# EAGLE board pork pi (EAGLE 6.5.0)
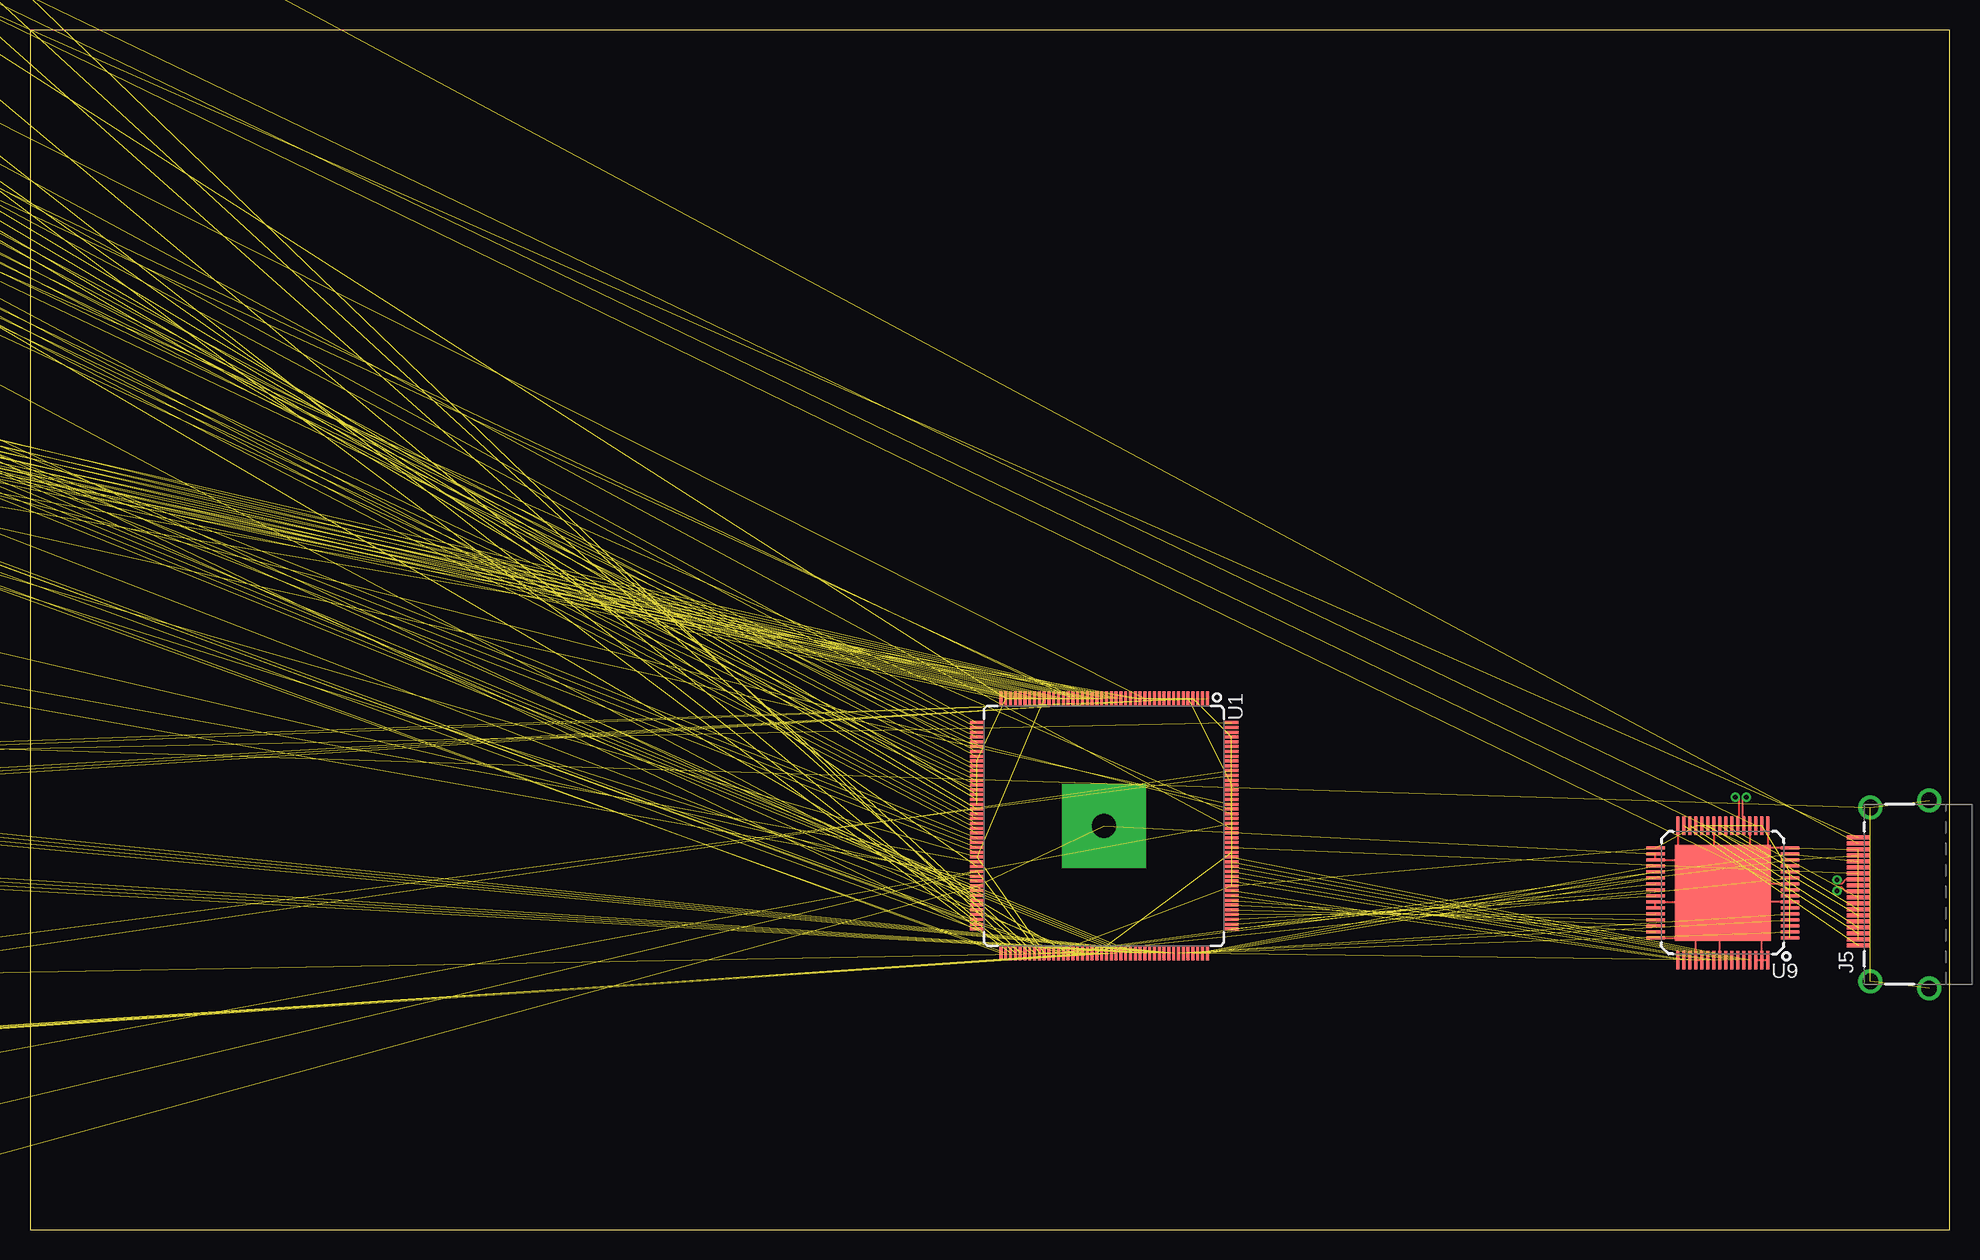
[diagram p3: board, top side]
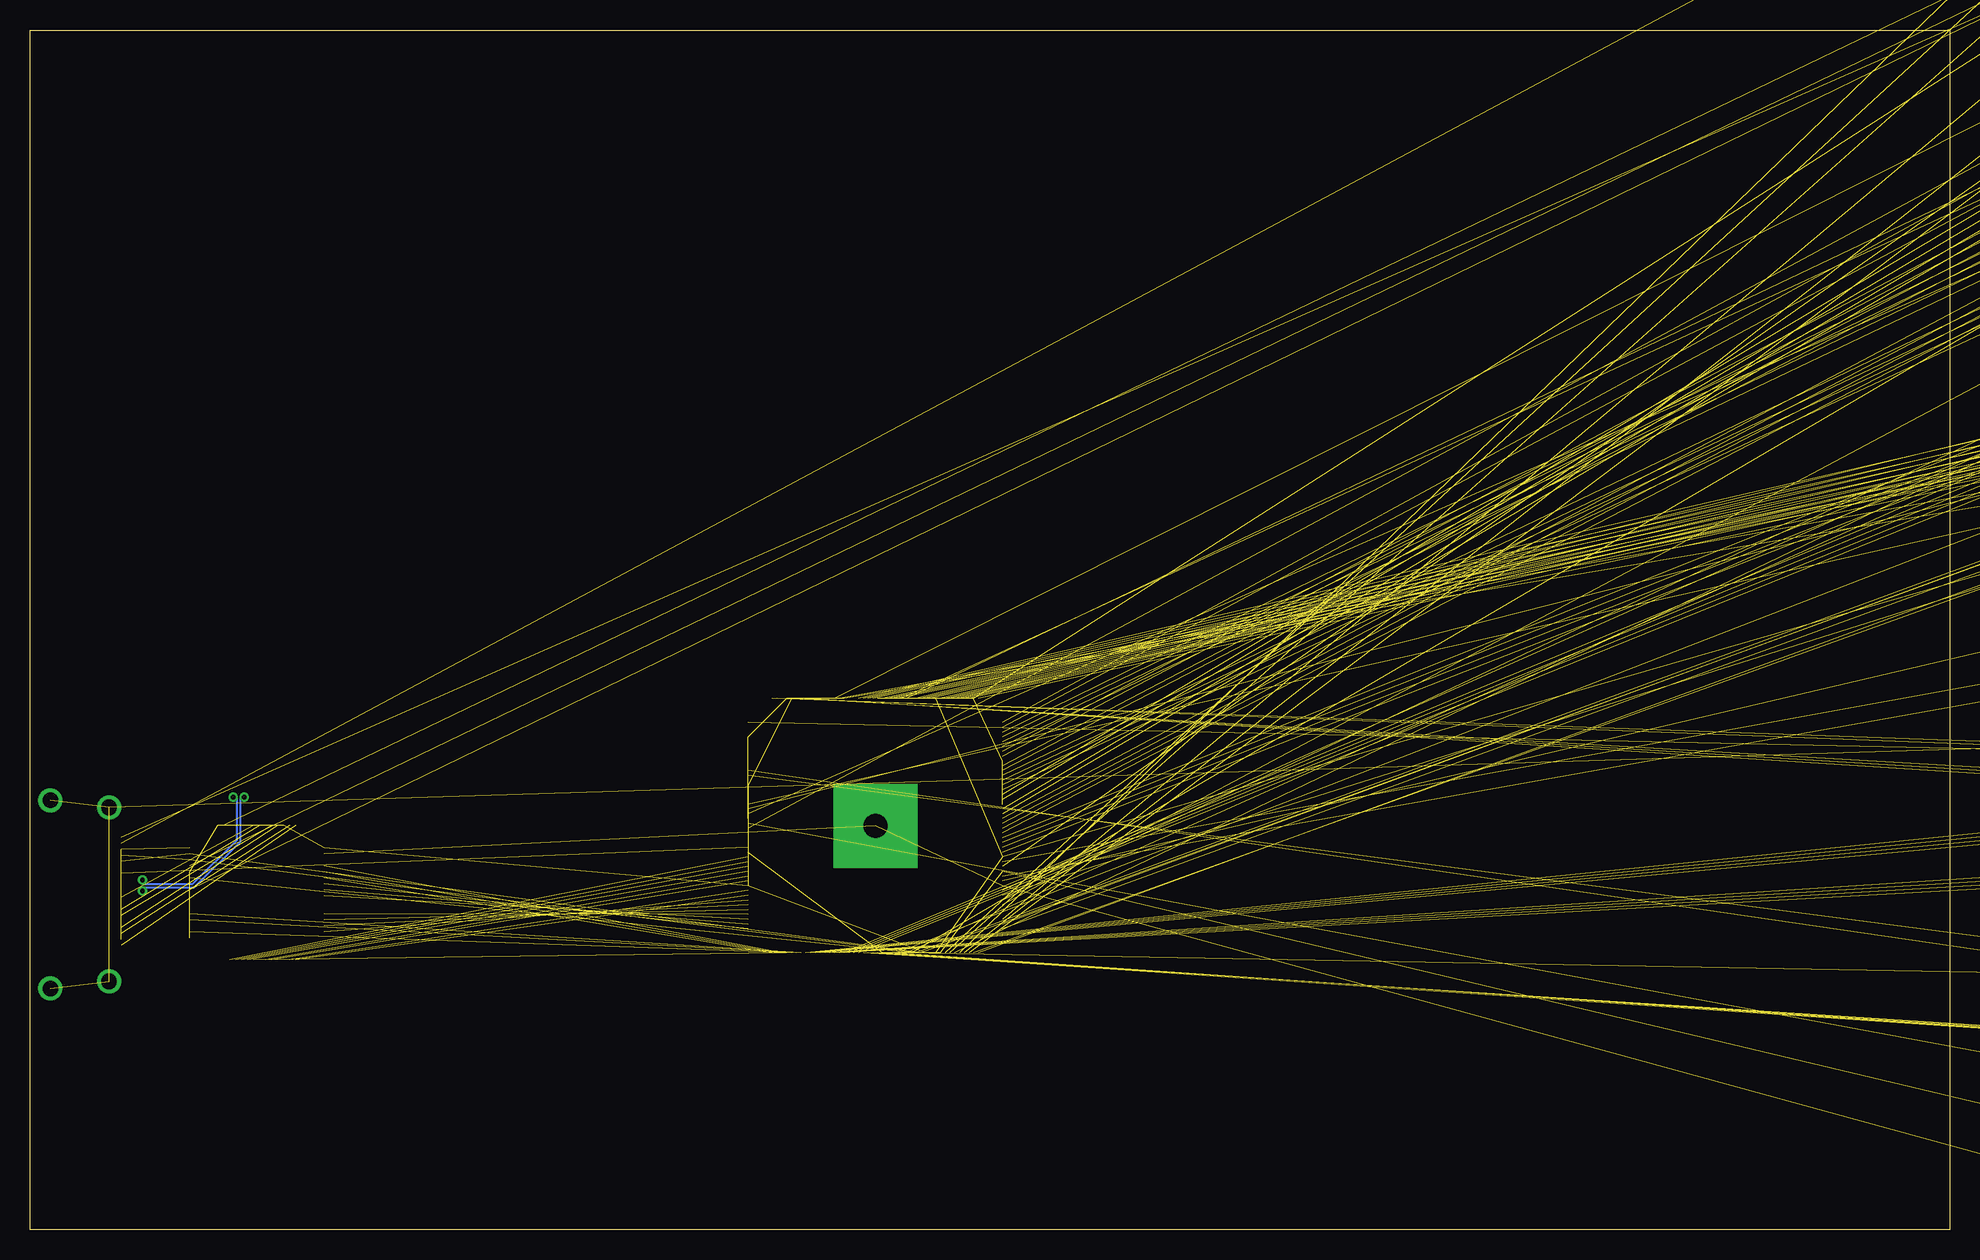
[diagram p4: board, bottom side, seen from below]

Size 160 x 100 mm. Coordinates in mm from the lower left corner, seen from the top.
Outline: 0,0 160,0 160,100 0,100 0,0
Copper layers (1*16): Top 0.0356mm / dielectric 1.5011mm / Bottom 0.0356mm
Design rules "LaenPCBOrder *": minimum track width 6mil, minimum drill 16mil, track to track 6mil, track to pad 6mil, pad to pad 6mil, via to via 6mil, smd to smd 6mil, copper to edge 15mil, drill to drill 6mil, minimum pad ring 7mil, minimum via ring 7mil, stop-mask expansion 3mil, vias tented up to drill 0mil, thermal gap 10mil

## Footprints (pad centres in the part's own frame; a part is rotated, then mirrored left to right if it is on the bottom)
0402-CAP = smd 0.6 x 0.6: 1 -0.55,0; 2 0.55,0
0603-CAP = smd 1.1 x 1: 1 -0.85,0; 2 0.85,0
CAP_POLYMER-6.5X6.5 = smd 1.6 x 3.5: + 0,2.8; - 0,-2.8
SOD123 = smd 1.6 x 0.8: ANODE 1.7,0; CATHODE -1.7,0
SOD-123 = smd 1.6 x 0.8: 1 -1.7,0; 2 1.7,0
SMC = smd 2.5 x 3.3: A 3.45,0; C -3.45,0
SJ-2523-SMT-TR = smd 2.4 x 2.95: 1 1.7,-3.275; 3 4.4,3.275 | smd 2.4 x 2.65: 2 11.4,-3.425; 4 11.4,3.425 | hole 1: 3,0; 9,0
JST-2-SMD = smd 1 x 4.6: 1 -1,-3.7; 2 1,-3.7 | smd 1.6 x 3.4: NC1 -3.4,1.5; NC2 3.4,1.5
MICRO-SD-SOCKET-PP = smd 0.8 x 1.5: 1 -8.94,10.7; 2 -7.84,10.3; 3 -6.74,10.7; 4 -5.64,10.9; 5 -4.54,10.7; 6 -3.44,10.9; 7 -2.34,10.7; 8 -1.24,10.7 | smd 1.8 x 1.4: CD1 -2.05,0.4; CD2 -7.75,0.4 | smd 1.4 x 1.9: GND1 -13.6,14.55; GND3 -0.45,13.55
POWER_JACK_PTH = drill 2.997 pad 4.318: GND 0,7.7; GNDBREAK 4.7,10.7; PWR 0,13.7
HDMI-SMD = smd 0.3 x 1.9: 1 -4.25,0; 2 -3.75,0; 3 -3.25,0; 4 -2.75,0; 5 -2.25,0; 6 -1.75,0; 7 -1.25,0; 8 -0.75,0; 9 -0.25,0; 10 0.25,0; 11 0.75,0; 12 1.25,0; 13 1.75,0; 14 2.25,0; 15 2.75,0; 16 3.25,0; 17 3.75,0; 18 4.25,0; 19 4.75,0 | drill 1.3 pad 2: P$1 7.25,-1; P$2 -7.25,-1; P$3 -7.85,-5.9; P$4 7.85,-5.9
ETHERNET = drill 0.9: 1 -4.445,6.37; 2 -3.175,8.91; 3 -1.905,6.37; 4 -0.635,8.91; 5 0.635,6.37; 6 1.905,8.91; 7 3.175,6.37; 8 4.445,8.91; L1 6.325,-3.35; L2 3.785,-4.87; L3 -3.785,-3.35; L4 -6.325,-4.87 | drill 1.6: P$5 7.775,3.08; P$6 -7.775,3.08 | hole 3.25: 5.715,0.03; -5.715,0.03
USB-MICROB = smd 0.35 x 1.4: D+ 0,2.65; D- -0.65,2.65; GND 1.3,2.65; ID 0.65,2.65; VBUS -1.3,2.65 | smd 1.8 x 1.9: MT1 -4,0; MT2 4,0 | smd 1.9 x 1.9: P$1 -1.27,0; P$2 1.27,0
USB-STACKED = drill 0.92: 1 -3.5,0; 2 -1,0; 3 1,0; 4 3.5,0; 5 -3.5,2.62; 6 -1,2.62; 7 1,2.62; 8 3.5,2.62; 9 -3.5,5.24; 10 -1,5.24; 11 1,5.24; 12 3.5,5.24 | drill 2.3: P$1 -6.57,-2.71; P$2 -6.57,2.97; P$3 6.57,2.97; P$4 6.57,-2.71
1X02 = drill 1.016 pad 1.88: 1 0,0; 2 2.54,0
SJ_3_PASTE1&2 = smd 0.635 x 1.27: 1 -0.813,0; 2 0,0; 3 0.813,0
1X04 = drill 1.016 pad 1.88 square: 1 0,0 | drill 1.016 pad 1.88: 2 2.54,0; 3 5.08,0; 4 7.62,0
NR6028T4R7M = smd 1.6 x 5.7: 1 -2.35,0; 2 2.35,0
0805 = smd 0.8 x 1.2: 1 -0.9,0; 2 0.9,0
LED-1206 = smd 1.2 x 1.4: A -1.5,0; C 1.5,0
2PT_GND_TIE = smd 1.27 x 0.635: P$1 0,0.635; P$2 0,-0.635
SOT23-3 = smd 0.8 x 1: 1 -0.95,-1; 2 0.95,-1; 3 0,1
0402-RES = smd 0.7 x 0.9: 1 -0.65,0; 2 0.65,0
RESISTOR_NETWORK-1206 = smd 0.8 x 0.7: 1 -0.85,-1.3; 4 -0.85,1.3; 5 0.85,-1.3; 8 0.85,1.3 | smd 0.8 x 0.5: 2 -0.85,-0.4; 3 -0.85,0.4; 6 0.85,-0.4; 7 0.85,0.4
FSMSM = smd 2.18 x 1.6: P$1 -4.59,0; P$2 4.59,0
A13 = smd 1.2 x 0.245: 1 -10.6,8.6; 2 -10.6,8.2; 3 -10.6,7.8; 4 -10.6,7.4; 5 -10.6,7; 6 -10.6,6.6; 7 -10.6,6.2; 8 -10.6,5.8; 9 -10.6,5.4; 10 -10.6,5; 11 -10.6,4.6; 12 -10.6,4.2; 13 -10.6,3.8; 14 -10.6,3.4; 15 -10.6,3; 16 -10.6,2.6; 17 -10.6,2.2; 18 -10.6,1.8; 19 -10.6,1.4; 20 -10.6,1; 21 -10.6,0.6; 22 -10.6,0.2; 23 -10.6,-0.2; 24 -10.6,-0.6; 25 -10.6,-1; 26 -10.6,-1.4; 27 -10.6,-1.8; 28 -10.6,-2.2; 29 -10.6,-2.6; 30 -10.6,-3; 31 -10.6,-3.4; 32 -10.6,-3.8; 33 -10.6,-4.2; 34 -10.6,-4.6; 35 -10.6,-5; 36 -10.6,-5.4; 37 -10.6,-5.8; 38 -10.6,-6.2; 39 -10.6,-6.6; 40 -10.6,-7; 41 -10.6,-7.4; 42 -10.6,-7.8; 43 -10.6,-8.2; 44 -10.6,-8.6; 89 10.6,-8.6; 90 10.6,-8.2; 91 10.6,-7.8; 92 10.6,-7.4; 93 10.6,-7; 94 10.6,-6.6; 95 10.6,-6.2; 96 10.6,-5.8; 97 10.6,-5.4; 98 10.6,-5; 99 10.6,-4.6; 100 10.6,-4.2; 101 10.6,-3.8; 102 10.6,-3.4; 103 10.6,-3; 104 10.6,-2.6; 105 10.6,-2.2; 106 10.6,-1.8; 107 10.6,-1.4; 108 10.6,-1; 109 10.6,-0.6; 110 10.6,-0.2; 111 10.6,0.2; 112 10.6,0.6; 113 10.6,1; 114 10.6,1.4; 115 10.6,1.8; 116 10.6,2.2; 117 10.6,2.6; 118 10.6,3; 119 10.6,3.4; 120 10.6,3.8; 121 10.6,4.2; 122 10.6,4.6; 123 10.6,5; 124 10.6,5.4; 125 10.6,5.8; 126 10.6,6.2; 127 10.6,6.6; 128 10.6,7; 129 10.6,7.4; 130 10.6,7.8; 131 10.6,8.2; 132 10.6,8.6 | smd 0.245 x 1.2: 45 -8.6,-10.6; 46 -8.2,-10.6; 47 -7.8,-10.6; 48 -7.4,-10.6; 49 -7,-10.6; 50 -6.6,-10.6; 51 -6.2,-10.6; 52 -5.8,-10.6; 53 -5.4,-10.6; 54 -5,-10.6; 55 -4.6,-10.6; 56 -4.2,-10.6; 57 -3.8,-10.6; 58 -3.4,-10.6; 59 -3,-10.6; 60 -2.6,-10.6; 61 -2.2,-10.6; 62 -1.8,-10.6; 63 -1.4,-10.6; 64 -1,-10.6; 65 -0.6,-10.6; 66 -0.2,-10.6; 67 0.2,-10.6; 68 0.6,-10.6; 69 1,-10.6; 70 1.4,-10.6; 71 1.8,-10.6; 72 2.2,-10.6; 73 2.6,-10.6; 74 3,-10.6; 75 3.4,-10.6; 76 3.8,-10.6; 77 4.2,-10.6; 78 4.6,-10.6; 79 5,-10.6; 80 5.4,-10.6; 81 5.8,-10.6; 82 6.2,-10.6; 83 6.6,-10.6; 84 7,-10.6; 85 7.4,-10.6; 86 7.8,-10.6; 87 8.2,-10.6; 88 8.6,-10.6; 133 8.6,10.6; 134 8.2,10.6; 135 7.8,10.6; 136 7.4,10.6; 137 7,10.6; 138 6.6,10.6; 139 6.2,10.6; 140 5.8,10.6; 141 5.4,10.6; 142 5,10.6; 143 4.6,10.6; 144 4.2,10.6; 145 3.8,10.6; 146 3.4,10.6; 147 3,10.6; 148 2.6,10.6; 149 2.2,10.6; 150 1.8,10.6; 151 1.4,10.6; 152 1,10.6; 153 0.6,10.6; 154 0.2,10.6; 155 -0.2,10.6; 156 -0.6,10.6; 157 -1,10.6; 158 -1.4,10.6; 159 -1.8,10.6; 160 -2.2,10.6; 161 -2.6,10.6; 162 -3,10.6; 163 -3.4,10.6; 164 -3.8,10.6; 165 -4.2,10.6; 166 -4.6,10.6; 167 -5,10.6; 168 -5.4,10.6; 169 -5.8,10.6; 170 -6.2,10.6; 171 -6.6,10.6; 172 -7,10.6; 173 -7.4,10.6; 174 -7.8,10.6; 175 -8.2,10.6; 176 -8.6,10.6 | drill 2 pad 7 square: EP 0,0
QFN-48 = smd 0.6 x 0.248: 1 -2.85,2.2; 2 -2.85,1.8; 3 -2.85,1.4; 4 -2.85,1; 5 -2.85,0.6; 6 -2.85,0.2; 7 -2.85,-0.2; 8 -2.85,-0.6; 9 -2.85,-1; 10 -2.85,-1.4; 11 -2.85,-1.8; 12 -2.85,-2.2; 25 2.85,-2.2; 26 2.85,-1.8; 27 2.85,-1.4; 28 2.85,-1; 29 2.85,-0.6; 30 2.85,-0.2; 31 2.85,0.2; 32 2.85,0.6; 33 2.85,1; 34 2.85,1.4; 35 2.85,1.8; 36 2.85,2.2 | smd 0.248 x 0.6: 13 -2.2,-2.85; 14 -1.8,-2.85; 15 -1.4,-2.85; 16 -1,-2.85; 17 -0.6,-2.85; 18 -0.2,-2.85; 19 0.2,-2.85; 20 0.6,-2.85; 21 1,-2.85; 22 1.4,-2.85; 23 1.8,-2.85; 24 2.2,-2.85; 37 2.2,2.85; 38 1.8,2.85; 39 1.4,2.85; 40 1,2.85; 41 0.6,2.85; 42 0.2,2.85; 43 -0.2,2.85; 44 -0.6,2.85; 45 -1,2.85; 46 -1.4,2.85; 47 -1.8,2.85; 48 -2.2,2.85 | drill 1.5 pad 4.05 square: EP 0,0
MSOP-8 = smd 1.35 x 0.45: 1 -1.975,0.975; 2 -1.975,0.325; 3 -1.975,-0.325; 4 -1.975,-0.975; 5 1.975,-0.975; 6 1.975,-0.318; 7 1.975,0.325; 8 1.975,0.975
HC-05 = smd 1.2 x 1: 1 -6.55,6; 2 -6.55,4.5; 3 -6.55,3; 4 -6.55,1.5; 5 -6.55,0; 6 -6.55,-1.5; 7 -6.55,-3; 8 -6.55,-4.5; 9 -6.55,-6; 10 -6.55,-7.5; 11 -6.55,-9; 12 -6.55,-10.5; 13 -6.55,-12; 22 6.55,-12; 23 6.55,-10.5; 24 6.55,-9; 25 6.55,-7.5; 26 6.55,-6; 27 6.55,-4.5; 28 6.55,-3; 29 6.55,-1.5; 30 6.55,0; 31 6.55,1.5; 32 6.55,3; 33 6.55,4.5; 34 6.55,6 | smd 1 x 1.2: 14 -5.25,-13.7; 15 -3.75,-13.7; 16 -2.25,-13.7; 17 -0.75,-13.7; 18 0.75,-13.7; 19 2.25,-13.7; 20 3.75,-13.7; 21 5.25,-13.7
MLF-8 = smd 0.6 x 0.295: 1 -0.9,0.75; 2 -0.9,0.25; 3 -0.9,-0.25; 4 -0.9,-0.75; 5 0.9,-0.75; 6 0.9,-0.25; 7 0.9,0.25; 8 0.9,0.75 | smd 0.75 x 2: EP 0,0
UDFN-10 = smd 0.6 x 0.3: 1 -1.355,1; 2 -1.355,0.5; 3 -1.355,0; 4 -1.355,-0.5; 5 -1.355,-1; 6 1.355,-1; 7 1.355,-0.5; 8 1.355,0; 9 1.355,0.5; 10 1.355,1 | smd 1.8 x 2.6: EP 0,0
DFN-8 = smd 0.9 x 0.5: 1 -1.85,1.2; 2 -1.85,0.4; 3 -1.85,-0.4; 4 -1.85,-1.2; 5 1.85,-1.2; 6 1.85,-0.4; 7 1.85,0.4; 8 1.85,1.2 | smd 2.39 x 3.2: EP 0,0
PQFP-64 = smd 1.55 x 0.25: 1 -5.6,3.75; 2 -5.6,3.25; 3 -5.6,2.75; 4 -5.6,2.25; 5 -5.6,1.75; 6 -5.6,1.25; 7 -5.6,0.75; 8 -5.6,0.25; 9 -5.6,-0.25; 10 -5.6,-0.75; 11 -5.6,-1.25; 12 -5.6,-1.75; 13 -5.6,-2.25; 14 -5.6,-2.75; 15 -5.6,-3.25; 16 -5.6,-3.75; 33 5.6,-3.75; 34 5.6,-3.25; 35 5.6,-2.75; 36 5.6,-2.25; 37 5.6,-1.75; 38 5.6,-1.25; 39 5.6,-0.75; 40 5.6,-0.25; 41 5.6,0.25; 42 5.6,0.75; 43 5.6,1.25; 44 5.6,1.75; 45 5.6,2.25; 46 5.6,2.75; 47 5.6,3.25; 48 5.6,3.75 | smd 0.25 x 1.55: 17 -3.75,-5.6; 18 -3.25,-5.6; 19 -2.75,-5.6; 20 -2.25,-5.6; 21 -1.75,-5.6; 22 -1.25,-5.6; 23 -0.75,-5.6; 24 -0.25,-5.6; 25 0.25,-5.6; 26 0.75,-5.6; 27 1.25,-5.6; 28 1.75,-5.6; 29 2.25,-5.6; 30 2.75,-5.6; 31 3.25,-5.6; 32 3.75,-5.6; 49 3.75,5.6; 50 3.25,5.6; 51 2.75,5.6; 52 2.25,5.6; 53 1.75,5.6; 54 1.25,5.6; 55 0.75,5.6; 56 0.25,5.6; 57 -0.25,5.6; 58 -0.75,5.6; 59 -1.25,5.6; 60 -1.75,5.6; 61 -2.25,5.6; 62 -2.75,5.6; 63 -3.25,5.6; 64 -3.75,5.6 | smd 8 x 8: EP 0,0
QFN-28 = smd 1 x 0.37: 1 -2.85,1.95; 2 -2.85,1.3; 3 -2.85,0.65; 4 -2.85,0; 5 -2.85,-0.65; 6 -2.85,-1.3; 7 -2.85,-1.95; 15 2.85,-1.95; 16 2.85,-1.3; 17 2.85,-0.65; 18 2.85,0; 19 2.85,0.65; 20 2.85,1.3; 21 2.85,1.95 | smd 0.37 x 1: 8 -1.95,-2.85; 9 -1.3,-2.85; 10 -0.65,-2.85; 11 0,-2.85; 12 0.65,-2.85; 13 1.3,-2.85; 14 1.95,-2.85; 22 1.95,2.85; 23 1.3,2.85; 24 0.65,2.85; 25 0,2.85; 26 -0.65,2.85; 27 -1.3,2.85; 28 -1.95,2.85 | smd 4.25 x 4.25: EP 0,0
TSOP1-48 = smd 1.2 x 0.3: 1 -9.6,5.75; 2 -9.6,5.25; 3 -9.6,4.75; 4 -9.6,4.25; 5 -9.6,3.75; 6 -9.6,3.25; 7 -9.6,2.75; 8 -9.6,2.25; 9 -9.6,1.75; 10 -9.6,1.25; 11 -9.6,0.75; 12 -9.6,0.25; 13 -9.6,-0.25; 14 -9.6,-0.75; 15 -9.6,-1.25; 16 -9.6,-1.75; 17 -9.6,-2.25; 18 -9.6,-2.75; 19 -9.6,-3.25; 20 -9.6,-3.75; 21 -9.6,-4.25; 22 -9.6,-4.75; 23 -9.6,-5.25; 24 -9.6,-5.75; 25 9.6,-5.75; 26 9.6,-5.25; 27 9.6,-4.75; 28 9.6,-4.25; 29 9.6,-3.75; 30 9.6,-3.25; 31 9.6,-2.75; 32 9.6,-2.25; 33 9.6,-1.75; 34 9.6,-1.25; 35 9.6,-0.75; 36 9.6,-0.25; 37 9.6,0.25; 38 9.6,0.75; 39 9.6,1.25; 40 9.6,1.75; 41 9.6,2.25; 42 9.6,2.75; 43 9.6,3.25; 44 9.6,3.75; 45 9.6,4.25; 46 9.6,4.75; 47 9.6,5.25; 48 9.6,5.75
LQFP-48 = smd 1.143 x 0.254: 1 -4.25,2.75; 2 -4.25,2.25; 3 -4.25,1.75; 4 -4.25,1.25; 5 -4.25,0.75; 6 -4.25,0.25; 7 -4.25,-0.25; 8 -4.25,-0.75; 9 -4.25,-1.25; 10 -4.25,-1.75; 11 -4.25,-2.25; 12 -4.25,-2.75; 25 4.25,-2.75; 26 4.25,-2.25; 27 4.25,-1.75; 28 4.25,-1.25; 29 4.25,-0.75; 30 4.25,-0.25; 31 4.25,0.25; 32 4.25,0.75; 33 4.25,1.25; 34 4.25,1.75; 35 4.25,2.25; 36 4.25,2.75 | smd 0.254 x 1.143: 13 -2.75,-4.25; 14 -2.25,-4.25; 15 -1.75,-4.25; 16 -1.25,-4.25; 17 -0.75,-4.25; 18 -0.25,-4.25; 19 0.25,-4.25; 20 0.75,-4.25; 21 1.25,-4.25; 22 1.75,-4.25; 23 2.25,-4.25; 24 2.75,-4.25; 37 2.75,4.25; 38 2.25,4.25; 39 1.75,4.25; 40 1.25,4.25; 41 0.75,4.25; 42 0.25,4.25; 43 -0.25,4.25; 44 -0.75,4.25; 45 -1.25,4.25; 46 -1.75,4.25; 47 -2.25,4.25; 48 -2.75,4.25
M06X1 = drill 1.016 pad 1.88 square: 1 -6.35,0 | drill 1.016 pad 1.88: 2 -3.81,0; 3 -1.27,0; 4 1.27,0; 5 3.81,0; 6 6.35,0
SON-8 = smd 0.85 x 0.35: 1 -1.475,0.975; 2 -1.475,0.325; 3 -1.475,-0.325; 4 -1.475,-0.975; 5 1.475,-0.975; 6 1.475,-0.325; 7 1.475,0.325; 8 1.475,0.975 | smd 1.65 x 2.4: EP 0,0
SOT-6 = smd 1 x 0.6: 1 -1.2,0.95; 2 -1.2,0; 3 -1.2,-0.95; 4 1.2,-0.95; 5 1.2,0; 6 1.2,0.95
DDR3_78 = smd 0.35 x 0.35: A1 -3.2,4.8; A2 -2.4,4.8; A3 -1.6,4.8; A7 1.6,4.8; A8 2.4,4.8; A9 3.2,4.8; B1 -3.2,4; B2 -2.4,4; B3 -1.6,4; B7 1.6,4; B8 2.4,4; B9 3.2,4; C1 -3.2,3.2; C2 -2.4,3.2; C3 -1.6,3.2; C7 1.6,3.2; C8 2.4,3.2; C9 3.2,3.2; D1 -3.2,2.4; D2 -2.4,2.4; D3 -1.6,2.4; D7 1.6,2.4; D8 2.4,2.4; D9 3.2,2.4; E1 -3.2,1.6; E2 -2.4,1.6; E3 -1.6,1.6; E7 1.6,1.6; E8 2.4,1.6; E9 3.2,1.6; F1 -3.2,0.8; F2 -2.4,0.8; F3 -1.6,0.8; F7 1.6,0.8; F8 2.4,0.8; F9 3.2,0.8; G1 -3.2,0; G2 -2.4,0; G3 -1.6,0; G7 1.6,0; G8 2.4,0; G9 3.2,0; H1 -3.2,-0.8; H2 -2.4,-0.8; H3 -1.6,-0.8; H7 1.6,-0.8; H8 2.4,-0.8; H9 3.2,-0.8; J1 -3.2,-1.6; J2 -2.4,-1.6; J3 -1.6,-1.6; J7 1.6,-1.6; J8 2.4,-1.6; J9 3.2,-1.6; K1 -3.2,-2.4; K2 -2.4,-2.4; K3 -1.6,-2.4; K7 1.6,-2.4; K8 2.4,-2.4; K9 3.2,-2.4; L1 -3.2,-3.2; L2 -2.4,-3.2; L3 -1.6,-3.2; L7 1.6,-3.2; L8 2.4,-3.2; L9 3.2,-3.2; M1 -3.2,-4; M2 -2.4,-4; M3 -1.6,-4; M7 1.6,-4; M8 2.4,-4; M9 3.2,-4; N1 -3.2,-4.8; N2 -2.4,-4.8; N3 -1.6,-4.8; N7 1.6,-4.8; N8 2.4,-4.8; N9 3.2,-4.8
FA-238 = smd 1.4 x 1.2: 1 -1.1,-0.8; 2 1.1,-0.8; 3 1.1,0.8; 4 -1.1,0.8

## Placement (x,y rotation side)
C1  1nF  [0402-CAP]  -30.48,118.11 0 top  (outside the outline)
C2  1uF  [0402-CAP]  -33.02,118.11 0 top  (outside the outline)
C3  0.1uF  [0402-CAP]  -35.56,118.11 0 top  (outside the outline)
C4  0.1uF  [0402-CAP]  -38.1,118.11 0 top  (outside the outline)
C5  0.1uF  [0402-CAP]  -40.64,118.11 0 top  (outside the outline)
C6  0.1uF  [0402-CAP]  -43.18,118.11 0 top  (outside the outline)
C7  10uF  [0603-CAP]  -93.98,97.79 0 top  (outside the outline)
C8  0.1uF  [0402-CAP]  -45.72,118.11 0 top  (outside the outline)
C9  10uF  [0603-CAP]  -97.79,97.79 0 top  (outside the outline)
C10  10uF  [0603-CAP]  -101.6,97.79 0 top  (outside the outline)
C11  0.1uF  [0402-CAP]  -48.26,118.11 0 top  (outside the outline)
C12  120uF  [CAP_POLYMER-6.5X6.5]  -64.77,57.15 0 top  (outside the outline)
C13  0.1uF  [0402-CAP]  -50.8,118.11 0 top  (outside the outline)
C14  22pF  [0402-CAP]  -53.34,118.11 0 top  (outside the outline)
C15  22pF  [0402-CAP]  -55.88,118.11 0 top  (outside the outline)
C16  10uF  [0603-CAP]  -105.41,97.79 0 top  (outside the outline)
C17  10uF  [0603-CAP]  -109.22,97.79 0 top  (outside the outline)
C18  10uF  [0603-CAP]  -15.24,102.87 0 top  (outside the outline)
C19  10uF  [0603-CAP]  -19.05,102.87 0 top  (outside the outline)
C20  10uF  [0603-CAP]  -22.86,102.87 0 top  (outside the outline)
C21  10uF  [0603-CAP]  -26.67,102.87 0 top  (outside the outline)
C22  10uF  [0603-CAP]  -30.48,102.87 0 top  (outside the outline)
C23  10uF  [0603-CAP]  -34.29,102.87 0 top  (outside the outline)
C24  1uF  [0402-CAP]  -58.42,118.11 0 top  (outside the outline)
C25  1uF  [0402-CAP]  -60.96,118.11 0 top  (outside the outline)
C26  1uF  [0402-CAP]  -63.5,118.11 0 top  (outside the outline)
C27  1nF  [0402-CAP]  -66.04,118.11 0 top  (outside the outline)
C28  10uF  [0603-CAP]  -38.1,102.87 0 top  (outside the outline)
C29  10uF  [0603-CAP]  -41.91,102.87 0 top  (outside the outline)
C30  10uF  [0603-CAP]  -45.72,102.87 0 top  (outside the outline)
C31  10uF  [0603-CAP]  -49.53,102.87 0 top  (outside the outline)
C32  10uF  [0603-CAP]  -53.34,102.87 0 top  (outside the outline)
C33  22uF  [0603-CAP]  -57.15,102.87 0 top  (outside the outline)
C34  22uF  [0603-CAP]  -60.96,102.87 0 top  (outside the outline)
C35  0.1uF  [0402-CAP]  -68.58,118.11 0 top  (outside the outline)
C36  0.1uF  [0402-CAP]  -71.12,118.11 0 top  (outside the outline)
C37  0.1uF  [0402-CAP]  -73.66,118.11 0 top  (outside the outline)
C38  0.1uF  [0402-CAP]  -76.2,118.11 0 top  (outside the outline)
C39  0.1uF  [0402-CAP]  -78.74,118.11 0 top  (outside the outline)
C40  0.1uF  [0402-CAP]  -81.28,118.11 0 top  (outside the outline)
C41  0.1uF  [0402-CAP]  -83.82,118.11 0 top  (outside the outline)
C42  0.1uF  [0402-CAP]  -86.36,118.11 0 top  (outside the outline)
C43  10uF  [0603-CAP]  -64.77,102.87 0 top  (outside the outline)
C44  10uF  [0603-CAP]  -68.58,102.87 0 top  (outside the outline)
C45  10uF  [0603-CAP]  -72.39,102.87 0 top  (outside the outline)
C46  22uF  [0603-CAP]  -76.2,102.87 0 top  (outside the outline)
C47  0.1uF  [0402-CAP]  -88.9,118.11 0 top  (outside the outline)
C48  10uF  [0603-CAP]  -80.01,102.87 0 top  (outside the outline)
C49  1uF  [0402-CAP]  -91.44,118.11 0 top  (outside the outline)
C50  22uF  [0603-CAP]  -83.82,102.87 0 top  (outside the outline)
C51  0.1uF  [0402-CAP]  -93.98,118.11 0 top  (outside the outline)
C52  0.1uF  [0402-CAP]  -96.52,118.11 0 top  (outside the outline)
C53  0.1uF  [0402-CAP]  -99.06,118.11 0 top  (outside the outline)
C54  10uF  [0603-CAP]  -87.63,102.87 0 top  (outside the outline)
C55  10uF  [0603-CAP]  -91.44,102.87 0 top  (outside the outline)
C56  10uF  [0603-CAP]  -95.25,102.87 0 top  (outside the outline)
C57  22uF  [0603-CAP]  -99.06,102.87 0 top  (outside the outline)
C58  0.1uF  [0402-CAP]  -101.6,118.11 0 top  (outside the outline)
C59  0.1uF  [0402-CAP]  -104.14,118.11 0 top  (outside the outline)
C60  10uF  [0603-CAP]  -102.87,102.87 0 top  (outside the outline)
C61  10uF  [0603-CAP]  -106.68,102.87 0 top  (outside the outline)
C62  22uF  [0603-CAP]  -15.24,106.68 0 top  (outside the outline)
C63  0.1uF  [0402-CAP]  -106.68,118.11 0 top  (outside the outline)
C64  0.1uF  [0402-CAP]  -109.22,118.11 0 top  (outside the outline)
C65  22uF  [0603-CAP]  -19.05,106.68 0 top  (outside the outline)
C66  0.1uF  [0402-CAP]  -13.97,121.92 0 top  (outside the outline)
C67  1nF  [0402-CAP]  -16.51,121.92 0 top  (outside the outline)
C68  1nF  [0402-CAP]  -19.05,121.92 0 top  (outside the outline)
C69  22pF  [0402-CAP]  -21.59,121.92 0 top  (outside the outline)
C70  22pF  [0402-CAP]  -24.13,121.92 0 top  (outside the outline)
C71  22uF  [0603-CAP]  -22.86,106.68 0 top  (outside the outline)
C72  0.1uF  [0402-CAP]  -26.67,121.92 0 top  (outside the outline)
C73  22uF  [0603-CAP]  -26.67,106.68 0 top  (outside the outline)
C74  22uF  [0603-CAP]  -30.48,106.68 0 top  (outside the outline)
C75  0.1uF  [0402-CAP]  -29.21,121.92 0 top  (outside the outline)
C76  22uF  [0603-CAP]  -34.29,106.68 0 top  (outside the outline)
C77  22uF  [0603-CAP]  -38.1,106.68 0 top  (outside the outline)
C78  22uF  [0603-CAP]  -41.91,106.68 0 top  (outside the outline)
C79  0.1uF  [0402-CAP]  -31.75,121.92 0 top  (outside the outline)
C80  10uF  [0603-CAP]  -45.72,106.68 0 top  (outside the outline)
C81  22uF  [0603-CAP]  -49.53,106.68 0 top  (outside the outline)
C82  0.1uF  [0402-CAP]  -34.29,121.92 0 top  (outside the outline)
C83  0.1uF  [0402-CAP]  -36.83,121.92 0 top  (outside the outline)
C84  0.1uF  [0402-CAP]  -39.37,121.92 0 top  (outside the outline)
C85  0.1uF  [0402-CAP]  -41.91,121.92 0 top  (outside the outline)
C86  0.1uF  [0402-CAP]  -44.45,121.92 0 top  (outside the outline)
C87  0.1uF  [0402-CAP]  -46.99,121.92 0 top  (outside the outline)
C88  0.1uF  [0402-CAP]  -49.53,121.92 0 top  (outside the outline)
C89  0.1uF  [0402-CAP]  -52.07,121.92 0 top  (outside the outline)
C90  0.1uF  [0402-CAP]  -54.61,121.92 0 top  (outside the outline)
C91  0.1uF  [0402-CAP]  -57.15,121.92 0 top  (outside the outline)
C92  0.1uF  [0402-CAP]  -59.69,121.92 0 top  (outside the outline)
C93  22uF  [0603-CAP]  -53.34,106.68 0 top  (outside the outline)
C94  0.1uF  [0402-CAP]  -62.23,121.92 0 top  (outside the outline)
C95  0.1uF  [0402-CAP]  -64.77,121.92 0 top  (outside the outline)
C96  0.1uF  [0402-CAP]  -67.31,121.92 0 top  (outside the outline)
C97  0.1uF  [0402-CAP]  -69.85,121.92 0 top  (outside the outline)
C98  0.1uF  [0402-CAP]  -72.39,121.92 0 top  (outside the outline)
C99  22uF  [0603-CAP]  -57.15,106.68 0 top  (outside the outline)
C100  0.1uF  [0402-CAP]  -74.93,121.92 0 top  (outside the outline)
C101  0.1uF  [0402-CAP]  -77.47,121.92 0 top  (outside the outline)
C102  0.1uF  [0402-CAP]  -80.01,121.92 0 top  (outside the outline)
C103  0.1uF  [0402-CAP]  -82.55,121.92 0 top  (outside the outline)
C104  0.1uF  [0402-CAP]  -85.09,121.92 0 top  (outside the outline)
C105  0.1uF  [0402-CAP]  -87.63,121.92 0 top  (outside the outline)
C106  0.1uF  [0402-CAP]  -90.17,121.92 0 top  (outside the outline)
C107  120uF  [CAP_POLYMER-6.5X6.5]  -72.39,57.15 0 top  (outside the outline)
C108  22pF  [0402-CAP]  -92.71,121.92 0 top  (outside the outline)
C109  22pF  [0402-CAP]  -95.25,121.92 0 top  (outside the outline)
C110  10uF  [0603-CAP]  -60.96,106.68 0 top  (outside the outline)
C111  0.1uF  [0402-CAP]  -97.79,121.92 0 top  (outside the outline)
C112  0.1uF  [0402-CAP]  -100.33,121.92 0 top  (outside the outline)
C113  22uF  [0603-CAP]  -64.77,106.68 0 top  (outside the outline)
C114  0.1uF  [0402-CAP]  -102.87,121.92 0 top  (outside the outline)
C115  0.1uF  [0402-CAP]  -105.41,121.92 0 top  (outside the outline)
C116  0.1uF  [0402-CAP]  -107.95,121.92 0 top  (outside the outline)
C117  0.1uF  [0402-CAP]  -13.97,124.46 0 top  (outside the outline)
C118  0.1uF  [0402-CAP]  -16.51,124.46 0 top  (outside the outline)
C119  22uF  [0603-CAP]  -68.58,106.68 0 top  (outside the outline)
C120  120uF  [CAP_POLYMER-6.5X6.5]  -80.01,57.15 0 top  (outside the outline)
C121  120uF  [CAP_POLYMER-6.5X6.5]  -87.63,57.15 0 top  (outside the outline)
C122  120uF  [CAP_POLYMER-6.5X6.5]  -95.25,57.15 0 top  (outside the outline)
C123  120uF  [CAP_POLYMER-6.5X6.5]  -102.87,57.15 0 top  (outside the outline)
C124  120uF  [CAP_POLYMER-6.5X6.5]  -16.51,69.85 0 top  (outside the outline)
C125  120uF  [CAP_POLYMER-6.5X6.5]  -24.13,69.85 0 top  (outside the outline)
C126  1uF  [0402-CAP]  -19.05,124.46 0 top  (outside the outline)
C127  1uF  [0402-CAP]  -21.59,124.46 0 top  (outside the outline)
C128  1uF  [0402-CAP]  -24.13,124.46 0 top  (outside the outline)
C129  22pF  [0402-CAP]  -26.67,124.46 0 top  (outside the outline)
C130  22pF  [0402-CAP]  -29.21,124.46 0 top  (outside the outline)
D1  1N5819  [SOD123]  -54.61,96.52 0 top  (outside the outline)
D2  1N4148W-TP  [SOD-123]  -48.26,96.52 0 top  (outside the outline)
D3  B340-13-F  [SMC]  -102.87,67.31 0 top  (outside the outline)
J1  SJ-2523-SMT-TR  [SJ-2523-SMT-TR]  -59.69,57.15 0 top  (outside the outline)
J2  [JST-2-SMD]  -33.02,71.12 0 top  (outside the outline)
J3  MICRO-SD  [MICRO-SD-SOCKET-PP]  -71.12,1.27 0 top  (outside the outline)
J4  POWER_JACKPTH  [POWER_JACK_PTH]  -38.1,30.48 0 top  (outside the outline)
J5  HDMI-SMD  [HDMI-SMD]  152.4,27.94 90 top
J6  RB1-125BAG1A  [ETHERNET]  -60.96,11.43 0 top  (outside the outline)
J7  USB+SHIELD-MICROB  [USB-MICROB]  -33.02,78.74 0 top  (outside the outline)
J8  USB-STACKED  [USB-STACKED]  -93.98,13.97 0 top  (outside the outline)
J9  USB-STACKED  [USB-STACKED]  -21.59,43.18 0 top  (outside the outline)
JP1  M02PTH  [1X02]  -20.32,78.74 0 top  (outside the outline)
JP2  JUMPER-31-2  [SJ_3_PASTE1&2]  -43.18,97.79 0 top  (outside the outline)
JP3  [1X04]  -107.95,91.44 0 top  (outside the outline)
L1  NR6028T4R7M  [NR6028T4R7M]  -48.26,68.58 0 top  (outside the outline)
L2  NR6028T4R7M  [NR6028T4R7M]  -55.88,68.58 0 top  (outside the outline)
L3  NR6028T4R7M  [NR6028T4R7M]  -63.5,68.58 0 top  (outside the outline)
L4  CK2125R47M-T  [0805]  -60.96,97.79 0 top  (outside the outline)
L5  NR6028T220M  [NR6028T4R7M]  -71.12,68.58 0 top  (outside the outline)
L6  NR6028T2R2N  [NR6028T4R7M]  -78.74,68.58 0 top  (outside the outline)
L7  NR6028T2R2N  [NR6028T4R7M]  -86.36,68.58 0 top  (outside the outline)
L8  NR6028T2R2N  [NR6028T4R7M]  -93.98,68.58 0 top  (outside the outline)
L9  600Ω 0.5A  [0805]  -64.77,97.79 0 top  (outside the outline)
LED1  [LED-1206]  -88.9,96.52 0 top  (outside the outline)
PT1  2PT_GND_TIE  [2PT_GND_TIE]  -35.56,124.46 0 top  (outside the outline)
PT2  2PT_GND_TIE  [2PT_GND_TIE]  -38.1,124.46 0 top  (outside the outline)
PT3  2PT_GND_TIE  [2PT_GND_TIE]  -40.64,124.46 0 top  (outside the outline)
PT4  2PT_GND_TIE  [2PT_GND_TIE]  -43.18,124.46 0 top  (outside the outline)
PT5  2PT_GND_TIE  [2PT_GND_TIE]  -45.72,124.46 0 top  (outside the outline)
PT6  2PT_GND_TIE  [2PT_GND_TIE]  -48.26,124.46 0 top  (outside the outline)
PT7  2PT_GND_TIE  [2PT_GND_TIE]  -50.8,124.46 0 top  (outside the outline)
PT8  2PT_GND_TIE  [2PT_GND_TIE]  -53.34,124.46 0 top  (outside the outline)
PT9  2PT_GND_TIE  [2PT_GND_TIE]  -55.88,124.46 0 top  (outside the outline)
Q1  DMP3098L-7  [SOT23-3]  -36.83,97.79 0 top  (outside the outline)
R1  47kΩ  [0402-RES]  -80.01,106.68 0 top  (outside the outline)
R2  6.8kΩ  [0402-RES]  -83.82,106.68 0 top  (outside the outline)
R3  8.2kΩ  [0402-RES]  -87.63,106.68 0 top  (outside the outline)
R4  10kΩ  [0402-RES]  -91.44,106.68 0 top  (outside the outline)
R5  11kΩ  [0402-RES]  -95.25,106.68 0 top  (outside the outline)
R6  13kΩ  [0402-RES]  -99.06,106.68 0 top  (outside the outline)
R7  100kΩ  [0402-RES]  -102.87,106.68 0 top  (outside the outline)
R8  47kΩ  [0402-RES]  -106.68,106.68 0 top  (outside the outline)
R9  470Ω  [0402-RES]  -15.24,110.49 0 top  (outside the outline)
R10  10kΩ  [0402-RES]  -19.05,110.49 0 top  (outside the outline)
R11  1.2kΩ  [0402-RES]  -22.86,110.49 0 top  (outside the outline)
R12  1Ω  [0402-RES]  -26.67,110.49 0 top  (outside the outline)
R13  2.2kΩ  [0402-RES]  -30.48,110.49 0 top  (outside the outline)
R14  2.2kΩ  [0402-RES]  -34.29,110.49 0 top  (outside the outline)
R15  10kΩ  [0402-RES]  -38.1,110.49 0 top  (outside the outline)
R16  6.8kΩ  [0402-RES]  -41.91,110.49 0 top  (outside the outline)
R17  13kΩ  [0402-RES]  -45.72,110.49 0 top  (outside the outline)
R18  2.2kΩ  [0402-RES]  -49.53,110.49 0 top  (outside the outline)
R19  0.03Ω  [0805]  -68.58,97.79 0 top  (outside the outline)
R20  2.2kΩ  [0402-RES]  -53.34,110.49 0 top  (outside the outline)
R21  2.2kΩ  [0402-RES]  -57.15,110.49 0 top  (outside the outline)
R22  240Ω  [0402-RES]  -60.96,110.49 0 top  (outside the outline)
R23  200kΩ  [0402-RES]  -64.77,110.49 0 top  (outside the outline)
R24  10kΩ  [0402-RES]  -68.58,110.49 0 top  (outside the outline)
R25  10kΩ  [0402-RES]  -72.39,110.49 0 top  (outside the outline)
R26  10kΩ  [0402-RES]  -76.2,110.49 0 top  (outside the outline)
R27  10kΩ  [0402-RES]  -80.01,110.49 0 top  (outside the outline)
R28  10kΩ  [0402-RES]  -83.82,110.49 0 top  (outside the outline)
R29  10kΩ  [0402-RES]  -87.63,110.49 0 top  (outside the outline)
R30  200kΩ  [0402-RES]  -91.44,110.49 0 top  (outside the outline)
R31  100kΩ  [0402-RES]  -95.25,110.49 0 top  (outside the outline)
R32  33kΩ  [0402-RES]  -99.06,110.49 0 top  (outside the outline)
R33  330kΩ  [0402-RES]  -102.87,110.49 0 top  (outside the outline)
R34  30kΩ  [0402-RES]  -106.68,110.49 0 top  (outside the outline)
R35  33kΩ  [0402-RES]  -15.24,114.3 0 top  (outside the outline)
R36  37kΩ  [0402-RES]  -19.05,114.3 0 top  (outside the outline)
R37  330kΩ  [0402-RES]  -22.86,114.3 0 top  (outside the outline)
R38  30kΩ  [0402-RES]  -26.67,114.3 0 top  (outside the outline)
R39  33kΩ  [0402-RES]  -30.48,114.3 0 top  (outside the outline)
R40  10.5kΩ  [0402-RES]  -34.29,114.3 0 top  (outside the outline)
R41  33kΩ  [0402-RES]  -38.1,114.3 0 top  (outside the outline)
R42  6.2kΩ  [0402-RES]  -41.91,114.3 0 top  (outside the outline)
R43  240Ω 1%  [0402-RES]  -72.39,106.68 0 top  (outside the outline)
R44  2kΩ 1%  [0402-RES]  -45.72,114.3 0 top  (outside the outline)
R45  2kΩ 1%  [0402-RES]  -49.53,114.3 0 top  (outside the outline)
R46  22Ω  [0402-RES]  -53.34,114.3 0 top  (outside the outline)
R47  22Ω  [0402-RES]  -57.15,114.3 0 top  (outside the outline)
R48  22Ω  [0402-RES]  -60.96,114.3 0 top  (outside the outline)
R49  22Ω  [0402-RES]  -64.77,114.3 0 top  (outside the outline)
R50  240Ω 1%  [0402-RES]  -76.2,106.68 0 top  (outside the outline)
R51  10kΩ  [0402-RES]  -68.58,114.3 0 top  (outside the outline)
R52  10kΩ  [0402-RES]  -72.39,114.3 0 top  (outside the outline)
R53  10kΩ  [0402-RES]  -76.2,114.3 0 top  (outside the outline)
R54  100Ω  [0402-RES]  -80.01,114.3 0 top  (outside the outline)
R55  100Ω  [0402-RES]  -83.82,114.3 0 top  (outside the outline)
R56  49.9Ω  [0805]  -72.39,97.79 0 top  (outside the outline)
R57  49.9Ω  [0805]  -76.2,97.79 0 top  (outside the outline)
R58  49.9Ω  [0805]  -80.01,97.79 0 top  (outside the outline)
R59  49.9Ω  [0805]  -83.82,97.79 0 top  (outside the outline)
R60  10kΩ  [0402-RES]  -87.63,114.3 0 top  (outside the outline)
R61  10kΩ  [0402-RES]  -91.44,114.3 0 top  (outside the outline)
R62  10kΩ  [0402-RES]  -95.25,114.3 0 top  (outside the outline)
R63  22Ω  [0402-RES]  -99.06,114.3 0 top  (outside the outline)
R64  22Ω  [0402-RES]  -102.87,114.3 0 top  (outside the outline)
R65  22Ω  [0402-RES]  -106.68,114.3 0 top  (outside the outline)
R66  22Ω  [0402-RES]  -15.24,118.11 0 top  (outside the outline)
R67  22Ω  [0402-RES]  -19.05,118.11 0 top  (outside the outline)
R68  22Ω  [0402-RES]  -22.86,118.11 0 top  (outside the outline)
R69  1.5kΩ  [0402-RES]  -26.67,118.11 0 top  (outside the outline)
RN1  22Ω  [RESISTOR_NETWORK-1206]  -92.71,85.09 0 top  (outside the outline)
RN2  22Ω  [RESISTOR_NETWORK-1206]  -97.79,85.09 0 top  (outside the outline)
RN3  22Ω  [RESISTOR_NETWORK-1206]  -102.87,85.09 0 top  (outside the outline)
RN4  22Ω  [RESISTOR_NETWORK-1206]  -107.95,85.09 0 top  (outside the outline)
RN5  22Ω  [RESISTOR_NETWORK-1206]  -16.51,91.44 0 top  (outside the outline)
RN6  22Ω  [RESISTOR_NETWORK-1206]  -21.59,91.44 0 top  (outside the outline)
RN7  22Ω  [RESISTOR_NETWORK-1206]  -26.67,91.44 0 top  (outside the outline)
RN8  22Ω  [RESISTOR_NETWORK-1206]  -31.75,91.44 0 top  (outside the outline)
RN9  22Ω  [RESISTOR_NETWORK-1206]  -36.83,91.44 0 top  (outside the outline)
RN10  22Ω  [RESISTOR_NETWORK-1206]  -55.88,85.09 0 top  (outside the outline)
RN11  22Ω  [RESISTOR_NETWORK-1206]  -87.63,85.09 0 top  (outside the outline)
RN12  22Ω  [RESISTOR_NETWORK-1206]  -62.23,85.09 0 top  (outside the outline)
RN13  22Ω  [RESISTOR_NETWORK-1206]  -68.58,85.09 0 top  (outside the outline)
RN14  22Ω  [RESISTOR_NETWORK-1206]  -74.93,85.09 0 top  (outside the outline)
RN15  22Ω  [RESISTOR_NETWORK-1206]  -81.28,85.09 0 top  (outside the outline)
S1  FSMSM  [FSMSM]  -57.15,77.47 0 top  (outside the outline)
S2  FSMSM  [FSMSM]  -69.85,77.47 0 top  (outside the outline)
S3  FSMSM  [FSMSM]  -82.55,77.47 0 top  (outside the outline)
S4  FSMSM  [FSMSM]  -95.25,77.47 0 top  (outside the outline)
S5  FSMSM  [FSMSM]  -19.05,85.09 0 top  (outside the outline)
S6  FSMSM  [FSMSM]  -31.75,85.09 0 top  (outside the outline)
S7  FSMSM  [FSMSM]  -44.45,85.09 0 top  (outside the outline)
U1  A13  [A13]  89.53,33.66 270 top
U2  AXP209  [QFN-48]  -40.64,68.58 0 top  (outside the outline)
U3  AP2161DM8G-13  [MSOP-8]  -55.88,91.44 0 top  (outside the outline)
U4  HC-05  [HC-05]  -20.32,15.24 0 top  (outside the outline)
U5  MIC2250YML  [MLF-8]  -33.02,124.46 0 top  (outside the outline)
U6  AP3409DNTR-G1  [UDFN-10]  -92.71,91.44 0 top  (outside the outline)
U7  AP3409DNTR-G1  [UDFN-10]  -96.52,91.44 0 top  (outside the outline)
U8  ST1S10PUR  [DFN-8]  -48.26,77.47 0 top  (outside the outline)
U9  TFP410  [PQFP-64]  141.1,28.07 180 top
U10  ENC28J60-QFN  [QFN-28]  -41.91,78.74 0 top  (outside the outline)
U11  NAND  [TSOP1-48]  -73.66,35.56 0 top  (outside the outline)
U12  TUSB2077  [LQFP-48]  -40.64,57.15 0 top  (outside the outline)
U13  HC-05-EZ  [M06X1]  -82.55,91.44 0 top  (outside the outline)
U14  TPS2042  [SON-8]  -40.64,91.44 0 top  (outside the outline)
U15  TPS2042  [SON-8]  -45.72,91.44 0 top  (outside the outline)
U16  TPS2042  [SON-8]  -50.8,91.44 0 top  (outside the outline)
U19  IP4220CZ6  [SOT-6]  -62.23,91.44 0 top  (outside the outline)
U20  IP4220CZ6  [SOT-6]  -67.31,91.44 0 top  (outside the outline)
U21  IP4220CZ6  [SOT-6]  -72.39,91.44 0 top  (outside the outline)
U$4  DDR3  [DDR3_78]  -46.99,36.83 0 top  (outside the outline)
U$5  DDR3  [DDR3_78]  -57.15,36.83 0 top  (outside the outline)
Y1  24MHz  [FA-238]  -15.24,97.79 0 top  (outside the outline)
Y2  25MHz  [FA-238]  -22.86,97.79 0 top  (outside the outline)
Y3  6MHz  [FA-238]  -30.48,97.79 0 top  (outside the outline)

## Tracks (layer width: path | path; a pad name or v marks a point on that pad's centre or on a via)
1.2V_CPU  (18 unrouted)
1.2V_INT  (12 unrouted)
1.5V_DDR  (54 unrouted)
3.0V  (4 unrouted)
3.3V  (70 unrouted)
3.3V-WIFI  (1 unrouted)
5V  (16 unrouted)
5V_RAW  (1 unrouted)
!DDR3_CAS!  (2 unrouted)
!DDR3_RAS!  (2 unrouted)
!DDR3_WE!  (2 unrouted)
!ETH_INT  (1 unrouted)
!NMI  (2 unrouted)
!RESET  (5 unrouted)
!VBUSEN  (2 unrouted)
BAT  (7 unrouted)
BT_KEY  (2 unrouted)
BT_LED  (1 unrouted)
CEC  (1 unrouted)
D0_N  (1 unrouted)
D0_P  (1 unrouted)
D1_N  (1 unrouted)
D1_P  (1 unrouted)
D2_N  (2 unrouted)
D2_P  (2 unrouted)
D3_N  (2 unrouted)
D3_P  (2 unrouted)
D4_N  (2 unrouted)
D4_P  (2 unrouted)
D5_N  (2 unrouted)
D5_P  (2 unrouted)
D6_N  (2 unrouted)
D6_P  (2 unrouted)
D7_N  (2 unrouted)
D7_P  (2 unrouted)
DDR3_A0  (2 unrouted)
DDR3_A1  (2 unrouted)
DDR3_A2  (2 unrouted)
DDR3_A3  (2 unrouted)
DDR3_A4  (2 unrouted)
DDR3_A5  (2 unrouted)
DDR3_A6  (2 unrouted)
DDR3_A7  (2 unrouted)
DDR3_A8  (2 unrouted)
DDR3_A9  (2 unrouted)
DDR3_A10  (2 unrouted)
DDR3_A11  (2 unrouted)
DDR3_A12  (2 unrouted)
DDR3_A13  (2 unrouted)
DDR3_A14  (2 unrouted)
DDR3_BA0  (2 unrouted)
DDR3_BA1  (2 unrouted)
DDR3_BA2  (2 unrouted)
DDR3_CK_N  (2 unrouted)
DDR3_CK_P  (2 unrouted)
DDR3_CKE  (2 unrouted)
DDR3_D0  (1 unrouted)
DDR3_D1  (1 unrouted)
DDR3_D2  (1 unrouted)
DDR3_D3  (1 unrouted)
DDR3_D4  (1 unrouted)
DDR3_D5  (1 unrouted)
DDR3_D6  (1 unrouted)
DDR3_D7  (1 unrouted)
DDR3_D8  (1 unrouted)
DDR3_D9  (1 unrouted)
DDR3_D10  (1 unrouted)
DDR3_D11  (1 unrouted)
DDR3_D12  (1 unrouted)
DDR3_D13  (1 unrouted)
DDR3_D14  (1 unrouted)
DDR3_D15  (1 unrouted)
DDR3_DM0  (1 unrouted)
DDR3_DM1  (1 unrouted)
DDR3_DQS0_N  (1 unrouted)
DDR3_DQS0_P  (1 unrouted)
DDR3_DQS1_N  (1 unrouted)
DDR3_DQS1_P  (1 unrouted)
DDR3_ODT  (2 unrouted)
DDR3_RST  (2 unrouted)
DDR_VREF  (9 unrouted)
ETH_CLK  (1 unrouted)
ETH_CS  (1 unrouted)
ETH_MISO  (1 unrouted)
ETH_MOSI  (1 unrouted)
FGND  (34 unrouted)
GND  (264 unrouted)
  Top 0.152: U9.48 137.35,24.32 U9.EP | U9.EP 138.85,25.82 U9.52 U9.53 | 140.59,28.32 138.09,30.82 U9.35 U9.34 | 140.59,28.32 141.6,27.3 141.6,27.56 U9.EP | U9.32 137.35,31.82 U9.EP | U9.26 140.35,28.82 U9.EP | U9.20 143.35,30.32 U9.EP | U9.17 144.85,31.82 U9.EP | U9.16 144.09,31.82 140.59,28.32 | U9.7 141.85,27.32 U9.EP | U9.7 U9.6 | U9.7 U9.8 | U9.10 141.85,28.82 U9.EP | U9.56 140.85,27.82 U9.EP | U9.63 144.35,24.82 U9.EP | U9.63 U9.64 | U9.62 U9.63 | U9.EP 140.35,27.32 U9.42 U9.43
HTPLG  (1 unrouted)
IPSOUT  (27 unrouted)
LX1  (5 unrouted)
MSEN  (2 unrouted)
N$1  (2 unrouted)
N$2  (1 unrouted)
N$3  (3 unrouted)
N$4  (2 unrouted)
N$5  (2 unrouted)
N$6  (2 unrouted)
N$7  (2 unrouted)
N$8  (2 unrouted)
N$9  (2 unrouted)
N$10  (2 unrouted)
N$11  (1 unrouted)
N$12  (1 unrouted)
N$13  (1 unrouted)
N$14  (2 unrouted)
N$15  (1 unrouted)
N$16  (2 unrouted)
N$17  (2 unrouted)
N$18  (1 unrouted)
N$19  (1 unrouted)
N$20  (1 unrouted)
N$21  (1 unrouted)
N$22  (1 unrouted)
N$23  (1 unrouted)
N$24  (1 unrouted)
N$25  (2 unrouted)
N$26  (1 unrouted)
N$27  (2 unrouted)
N$28  (1 unrouted)
N$29  (2 unrouted)
N$30  (2 unrouted)
N$31  (2 unrouted)
N$32  (1 unrouted)
N$33  (3 unrouted)
N$34  (3 unrouted)
N$35  (1 unrouted)
N$36  (2 unrouted)
N$37  (1 unrouted)
N$38  (2 unrouted)
N$39  (2 unrouted)
N$40  (4 unrouted)
N$41  (1 unrouted)
N$42  (1 unrouted)
N$43  (1 unrouted)
N$44  (1 unrouted)
N$45  (1 unrouted)
N$46  (1 unrouted)
N$47  (1 unrouted)
N$48  (2 unrouted)
N$49  (6 unrouted)
N$50  (3 unrouted)
N$51  (2 unrouted)
N$52  (1 unrouted)
N$53  (3 unrouted)
N$54  (5 unrouted)
N$55  (2 unrouted)
N$56  (1 unrouted)
N$57  (1 unrouted)
N$58  (1 unrouted)
N$59  (1 unrouted)
N$60  (1 unrouted)
N$61  (1 unrouted)
N$62  (1 unrouted)
N$63  (1 unrouted)
N$64  (1 unrouted)
N$65  (1 unrouted)
N$66  (1 unrouted)
N$67  (1 unrouted)
N$68  (1 unrouted)
N$69  (1 unrouted)
N$70  (1 unrouted)
N$71  (1 unrouted)
N$72  (1 unrouted)
N$73  (1 unrouted)
N$74  (1 unrouted)
N$75  (1 unrouted)
N$76  (1 unrouted)
N$77  (1 unrouted)
N$78  (1 unrouted)
N$79  (1 unrouted)
N$80  (1 unrouted)
N$81  (1 unrouted)
N$82  (1 unrouted)
N$83  (1 unrouted)
N$84  (1 unrouted)
N$85  (1 unrouted)
N$86  (1 unrouted)
N$87  (1 unrouted)
N$88  (1 unrouted)
N$89  (1 unrouted)
N$90  (1 unrouted)
N$91  (1 unrouted)
N$92  (1 unrouted)
N$93  (1 unrouted)
N$94  (1 unrouted)
N$95  (1 unrouted)
N$96  (1 unrouted)
N$97  (1 unrouted)
N$98  (1 unrouted)
N$99  (1 unrouted)
N$100  (1 unrouted)
N$101  (1 unrouted)
N$102  (1 unrouted)
N$103  (1 unrouted)
N$104  (1 unrouted)
N$105  (1 unrouted)
N$106  (1 unrouted)
N$107  (1 unrouted)
N$108  (1 unrouted)
N$109  (1 unrouted)
N$110  (1 unrouted)
N$111  (1 unrouted)
N$112  (1 unrouted)
N$113  (1 unrouted)
N$114  (1 unrouted)
N$115  (1 unrouted)
N$116  (1 unrouted)
N$117  (1 unrouted)
N$118  (1 unrouted)
N$119  (1 unrouted)
N$120  (1 unrouted)
N$121  (1 unrouted)
N$122  (1 unrouted)
N$123  (1 unrouted)
N$124  (1 unrouted)
N$125  (1 unrouted)
N$126  (1 unrouted)
N$127  (1 unrouted)
N$128  (1 unrouted)
N$129  (1 unrouted)
N$138  (2 unrouted)
N$139  (2 unrouted)
N$140  (1 unrouted)
N$141  (1 unrouted)
N$142  (1 unrouted)
N$143  (1 unrouted)
N$144  (1 unrouted)
N$145  (1 unrouted)
N$146  (1 unrouted)
N$147  (2 unrouted)
N$148  (2 unrouted)
N$149  (2 unrouted)
N$150  (2 unrouted)
N$151  (4 unrouted)
N$152  (1 unrouted)
N$153  (1 unrouted)
N$154  (1 unrouted)
N$155  (1 unrouted)
N$156  (1 unrouted)
N$157  (1 unrouted)
N$158  (1 unrouted)
N$159  (1 unrouted)
N$160  (2 unrouted)
N$161  (2 unrouted)
N$162  (1 unrouted)
N$163  (1 unrouted)
N$164  (1 unrouted)
N$165  (1 unrouted)
N$166  (2 unrouted)
N$167  (1 unrouted)
N$168  (1 unrouted)
N$169  (1 unrouted)
N$170  (1 unrouted)
N$171  (1 unrouted)
N$172  (1 unrouted)
N$173  (1 unrouted)
N$174  (1 unrouted)
N$175  (1 unrouted)
N$176  (1 unrouted)
N$177  (1 unrouted)
N$178  (1 unrouted)
N$179  (1 unrouted)
N$180  (1 unrouted)
N$181  (1 unrouted)
N$182  (1 unrouted)
N$183  (2 unrouted)
N$184  (2 unrouted)
N$185  (2 unrouted)
N$186  (1 unrouted)
N$187  (1 unrouted)
N$188  (1 unrouted)
N$189  (1 unrouted)
N$190  (2 unrouted)
N$191  (1 unrouted)
N$192  (1 unrouted)
N$193  (1 unrouted)
N$194  (1 unrouted)
N$195  (2 unrouted)
N$196  (1 unrouted)
N$197  (1 unrouted)
N$198  (2 unrouted)
N$199  (1 unrouted)
N$200  (1 unrouted)
N$201  (2 unrouted)
N$202  (2 unrouted)
N$203  (1 unrouted)
N$204  (1 unrouted)
N$205  (2 unrouted)
N$206  (1 unrouted)
N$207  (1 unrouted)
OTG_PWR  (1 unrouted)
PWRON  (2 unrouted)
SCL  (4 unrouted)
SDA  (4 unrouted)
SDC0_CD  (2 unrouted)
T0_N  (1 unrouted)
T0_P  (1 unrouted)
T1_N  (1 unrouted)
T1_P  (1 unrouted)
T2_N  (1 unrouted)
T2_P  (1 unrouted)
TC_N  (via drill 0.41)
  Top 0.152: J5.12 151.36,29.19 151,28.83 150.62,28.83 v150.62,29.13 | v143.05,36.04 142.75,36.04 142.75,34.52 142.85,34.42 U9.21
  Bottom 0.152: v150.62,29.13 150.62,28.83 146.42,28.83 142.75,32.5 142.75,36.04 v143.05,36.04
TC_P  (via drill 0.41)
  Top 0.152: J5.10 151.34,28.19 151,28.52 150.62,28.52 v150.62,28.22 | v142.14,36.04 142.44,36.04 142.44,34.52 142.35,34.42 U9.22
  Bottom 0.152: v150.62,28.22 150.62,28.52 146.29,28.52 142.44,32.37 142.44,36.04 v142.14,36.04
UART1_RX  (2 unrouted)
UART1_TX  (2 unrouted)
UBOOT  (2 unrouted)
VINT  (2 unrouted)
VUSB  (5 unrouted)
VUSBDET  (2 unrouted)
VUSBFLG  (2 unrouted)